# Altium schematic sheet Output.SchDoc: OUTPUT
size A4
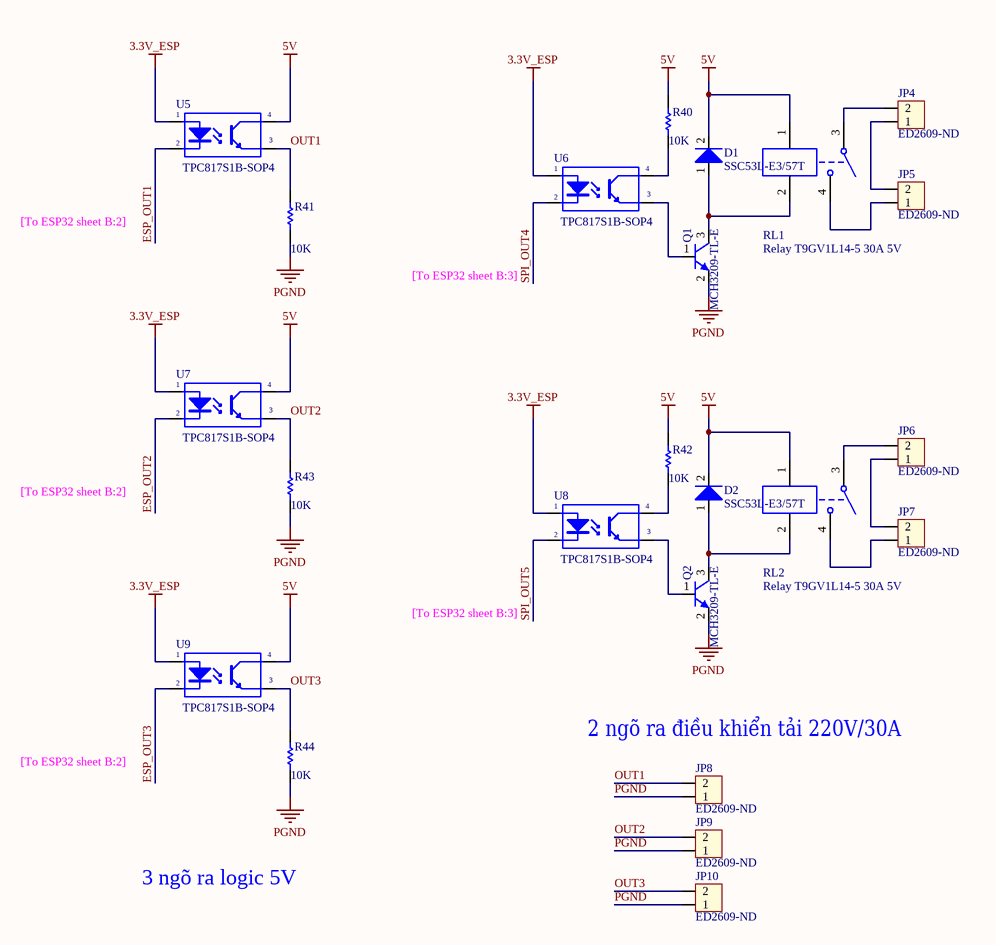
[diagram p0: Output.SchDoc]

## Parts
D1  SSC53L-E3/57T  [SSC53L-E3/57T]
D2  SSC53L-E3/57T  [SSC53L-E3/57T]
JP4  ED2609-ND  [DOMINO_OSTTC_2P]
JP5  ED2609-ND  [DOMINO_OSTTC_2P]
JP6  ED2609-ND  [DOMINO_OSTTC_2P]
JP7  ED2609-ND  [DOMINO_OSTTC_2P]
JP8  ED2609-ND  [DOMINO_OSTTC_2P]
JP9  ED2609-ND  [DOMINO_OSTTC_2P]
JP10  ED2609-ND  [DOMINO_OSTTC_2P]
Q1  MCH3209-TL-E  [MCH3209-TL-E  SOT-323]
Q2  MCH3209-TL-E  [MCH3209-TL-E  SOT-323]
R40  10K  [Res 0805 SMD]
R41  10K  [Res 0805 SMD]
R42  10K  [Res 0805 SMD]
R43  10K  [Res 0805 SMD]
R44  10K  [Res 0805 SMD]
RL1  Relay T9GV1L14-5 30A 5V  [Relay T9GV1L14-5 30A 5V]
RL2  Relay T9GV1L14-5 30A 5V  [Relay T9GV1L14-5 30A 5V]
U5  TPC817S1B-SOP4  [TPC817-4SOP]
U6  TPC817S1B-SOP4  [TPC817-4SOP]
U7  TPC817S1B-SOP4  [TPC817-4SOP]
U8  TPC817S1B-SOP4  [TPC817-4SOP]
U9  TPC817S1B-SOP4  [TPC817-4SOP]

## Nets
3.3V_ESP: U5.1(A) U6.1(A) U7.1(A) U8.1(A) U9.1(A)
5V: D1.2(K) D2.2(K) R40.2 R42.2 RL1.1 RL2.1 U5.4(C) U7.4(C) U9.4(C)
PGND: JP8.1 JP9.1 JP10.1 Q1.2(E) Q2.2(E) R41.1 R43.1 R44.1
ESP_OUT1: U5.2(K)
ESP_OUT2: U7.2(K)
ESP_OUT3: U9.2(K)
OUT1: JP8.2 R41.2 U5.3(E)
OUT2: JP9.2 R43.2 U7.3(E)
OUT3: JP10.2 R44.2 U9.3(E)
SPI_OUT4: U6.2(K)
SPI_OUT5: U8.2(K)
NetD1_1: D1.1(A) Q1.3(C) RL1.2
NetD2_1: D2.1(A) Q2.3(C) RL2.2
NetJP4_1: JP4.1 JP5.2
NetJP4_2: JP4.2 RL1.3
NetJP5_1: JP5.1 RL1.4
NetJP6_1: JP6.1 JP7.2
NetJP6_2: JP6.2 RL2.3
NetJP7_1: JP7.1 RL2.4
NetQ1_1: Q1.1(B) U6.3(E)
NetQ2_1: Q2.1(B) U8.3(E)
NetR40_1: R40.1 U6.4(C)
NetR42_1: R42.1 U8.4(C)

## Notes on the sheet
- [To ESP32 sheet B:2]
- [To ESP32 sheet B:3]
- (near JP8) 2 ngõ ra điều khiển tải 220V/30A
- 3 ngõ ra logic 5V
- Title
- Size:
- Date:
- A4
- Number:
- Time:
- Revision:
- Sheet
- of
- File:

## Library data of the parts
D1 D2 = 10A10: DIODE SCHOTTKY 30V 5A DO214AB; ComponentLink1Description: Datasheet; ComponentLink1URL: D:\Dropbox\Datasheets\Diodes and Rectifiers\Diodes\10AXX.pdf; Digikey: SSC53L-E3/57TGICT-ND
JP4-JP10 = Con2: 2 Position Wire to Board Terminal Block Horizontal with Board 0.200" (5.08mm) Through Hole; Value: Connector 2; Digikey: ED2609-ND
Q1 Q2 = 2SC1815: Bipolar (BJT) Transistor NPN 30V 3A 450MHz 800mW Surface Mount 3-MCPH; ComponentLink1Description: Datasheet; ComponentLink1URL: D:\Dropbox\Datasheets\Transistors\P Channel Bipolar\2SC1815.pdf; Digikey: MCH3209-TL-EOSCT-ND
R40-R44 = 249K/R0805/1%: RES SMD 249K OHM 1% 1/10W 0805; Manufacturer: Yageo; Manufacturer Part Number: RC0603FR-07249KL; Power (Watts): 0.1W, 1/10W; Temperature Coefficient: ±100ppm/°C; Supplier 1: Digi-Key; RoHS: RoHS Compliant; Category: Resistors; Stock 1: 370515; Pricing 1: 1=0.1, 10=0.015, 100=0.006, 1000=0.00268, 2500=0.00233 (USD); Packaging: Cut Tape (CT); Part Status: Active; Tolerance: ±1%; Composition: Thick Film; Features: Moisture Resistant; Operating Temperature: -55°C ~ 155°C; Package / Case: 0603 (1608 Metric); Supplier Device Package: 0603; Size / Dimension: 0.063" L x 0.032" W (1.60mm x 0.80mm); Height - Seated (Max): 0.022" (0.55mm); Failure Rate: -; ComponentLink1URL: http://www.yageo.com/documents/recent/PYu-RC_Group_51_RoHS_L_8.pdf; ComponentLink1Description: http://www.yageo.com/documents/recent/PYu-RC_Group_51_RoHS_L_8.pdf
RL1 RL2 = Relay T9GV1L14-5 30A 5V: General Purpose Relay SPST-NO (1 Form A) 5VDC Coil Through Hole; Digikey: T9GV1L14-5
U5-U9 = PC817: Optoisolator Transistor Output 5000Vrms 1 Channel 4-SOP; Digikey: TPC817S1BRAGCT-ND